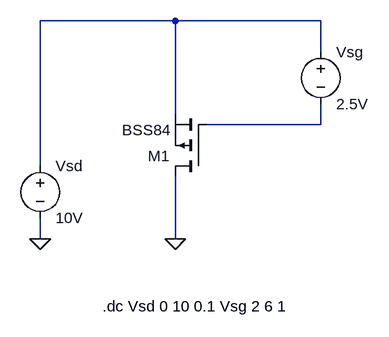
[diagram p0: schematic Question 4.asc]
Question 4.asc, the LTspice schematic file:
Version 4.1
SHEET 1 880 680
WIRE 32 80 -176 80
WIRE 256 80 32 80
WIRE 256 128 256 80
WIRE 32 224 32 80
WIRE 256 240 256 208
WIRE 256 240 80 240
WIRE -176 304 -176 80
WIRE -176 416 -176 384
WIRE 32 416 32 320
FLAG 32 416 0
FLAG -176 416 0
SYMBOL pmos 80 320 R180
SYMATTR InstName M1
SYMATTR Value BSS84
SYMBOL voltage -176 288 R0
SYMATTR InstName Vsd
SYMATTR Value 10V
SYMBOL voltage 256 112 R0
SYMATTR InstName Vsg
SYMATTR Value 2.5V
TEXT -80 520 Left 2 !.dc Vsd 0 10 0.1 Vsg 2 6 1

The netlist it stands for:
* Question 4.asc
M1 0 N002 N001 N001 BSS84
Vsd N001 0 10V
Vsg N001 N002 2.5V
.model NMOS NMOS
.model PMOS PMOS
.lib standard.mos
.dc Vsd 0 10 0.1 Vsg 2 6 1
.backanno
.end